# Altium schematic sheet RS485_ISL8491.SchDoc: RS485 Communication IC
size A4; DocumentNumber: 35; SheetNumber: 36; SheetTotal: 78
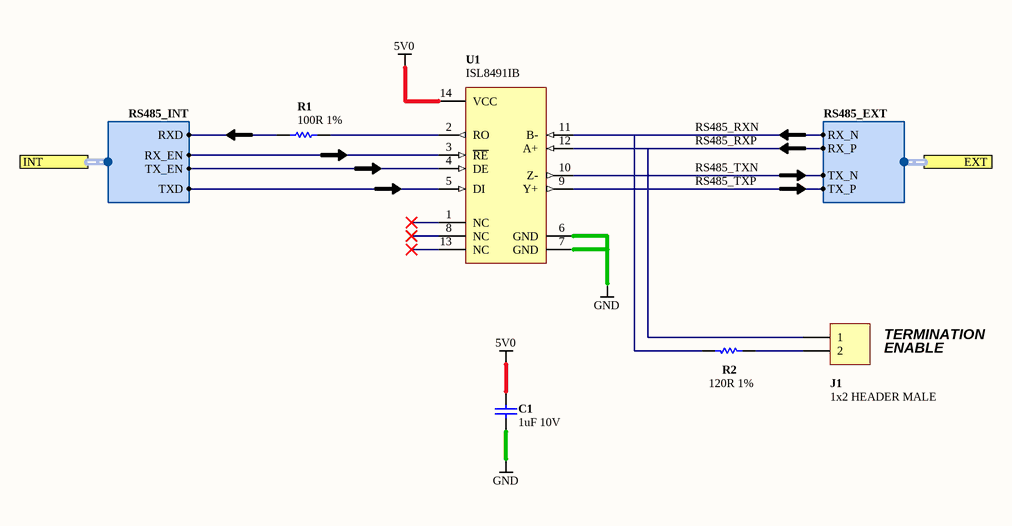
[diagram p0: RS485_ISL8491.SchDoc]

## Parts
C1  1uF 10V  [CAPC1005-STAR]
J1  1x2 HEADER MALE  [HDR1X2]
R1  100R 1%  [RESC1005-STAR]
R2  120R 1%  [RESC1005-STAR]
U1  ISL8491IB  [SOIC127P600-14N]

## Ports
EXT (harness RS485_EXT), INT (harness RS485_INT)

## Harnesses
RS485_INT: TX_EN, RXD, RX_EN, TXD
RS485_EXT: TX_N, RX_N, RX_P, TX_P

## Nets
5V0: C1.2 U1.14(VCC)
GND: C1.1 U1.6(GND) U1.7(GND)
RS485_RXN: R2.1 U1.11(B-) ; port EXT.RX_N
RS485_RXP: J1.1 U1.12(A+) ; port EXT.RX_P
RS485_TXN: U1.10(Z-) ; port EXT.TX_N
RS485_TXP: U1.9(Y+) ; port EXT.TX_P
NetJ1_2: J1.2 R2.2
NetR1_1: R1.1 ; port INT.RXD
NetR1_2: R1.2 U1.2(RO)
NetU1_3: U1.3(~{RE}) ; port INT.RX_EN
NetU1_4: U1.4(DE) ; port INT.TX_EN
NetU1_5: U1.5(DI) ; port INT.TXD

Not connected (* = marked no-connect by the designer): U1 1(NC)* 8(NC)* 13(NC)*

## Notes on the sheet
- TERMINATION
- ENABLE
- Sheet Title
- Project Title
- Size:
- Date:
- A4
- Assy:
- Time:
- Revision:
- Sheet
- of
- File:

## Library data of the parts
C1 = D-101-0131: Capacitor, Ceramic, 1uF 10% 10V 0402 (1005) X5R; Polarity: Non-Polarized; Category: Capacitor; Capacitance: 1 uF; Dielectric: X5R; Mounting Technology: Surface Mount; Rated Voltage: 10 V; Status: Unreleased; Technology: None; Tolerance: 10 %
J1 = D-300-0020: Header IDC, 2 x 1 Pin Vertical 2.54mm Pitch (Non-Boxed, Male); Max Current: 3 A; Category: Connector; Connector type: Header; Mounting Technology: Through-Hole; Pin Count: 2; Status: Production
R1 = D-100-0131: Resistor, 100R 1% 0402 (1005); Power Rating: 63 mW; Category: Resistor; Mounting Technology: Surface Mount; Resistance: 100 R; Status: Production; Tolerance: 1 %
R2 = D-100-0126: Resistor, 120R 1% 0402 (1005); Power Rating: 63 mW; Category: Resistor; Mounting Technology: Surface Mount; Resistance: 120 R; Status: Production; Tolerance: 1 %
U1 = D-221-0016: ISL8491IB, RS-485/RS-422 Transceivers; Comm Standard: None; Mounting Technology: Surface Mount; Status: Unreleased; Temperature Range: -40 to +85 degC; Category: IC-Communication